# Altium schematic sheet [16] SPI_TYPEC_PWR.SchDoc
size B; Organization: Altium Limited; Address1: L3, 12a Rodborough Rd; Address2: Frenchs Forest; Address3: NSW; Address4: Australia 2086
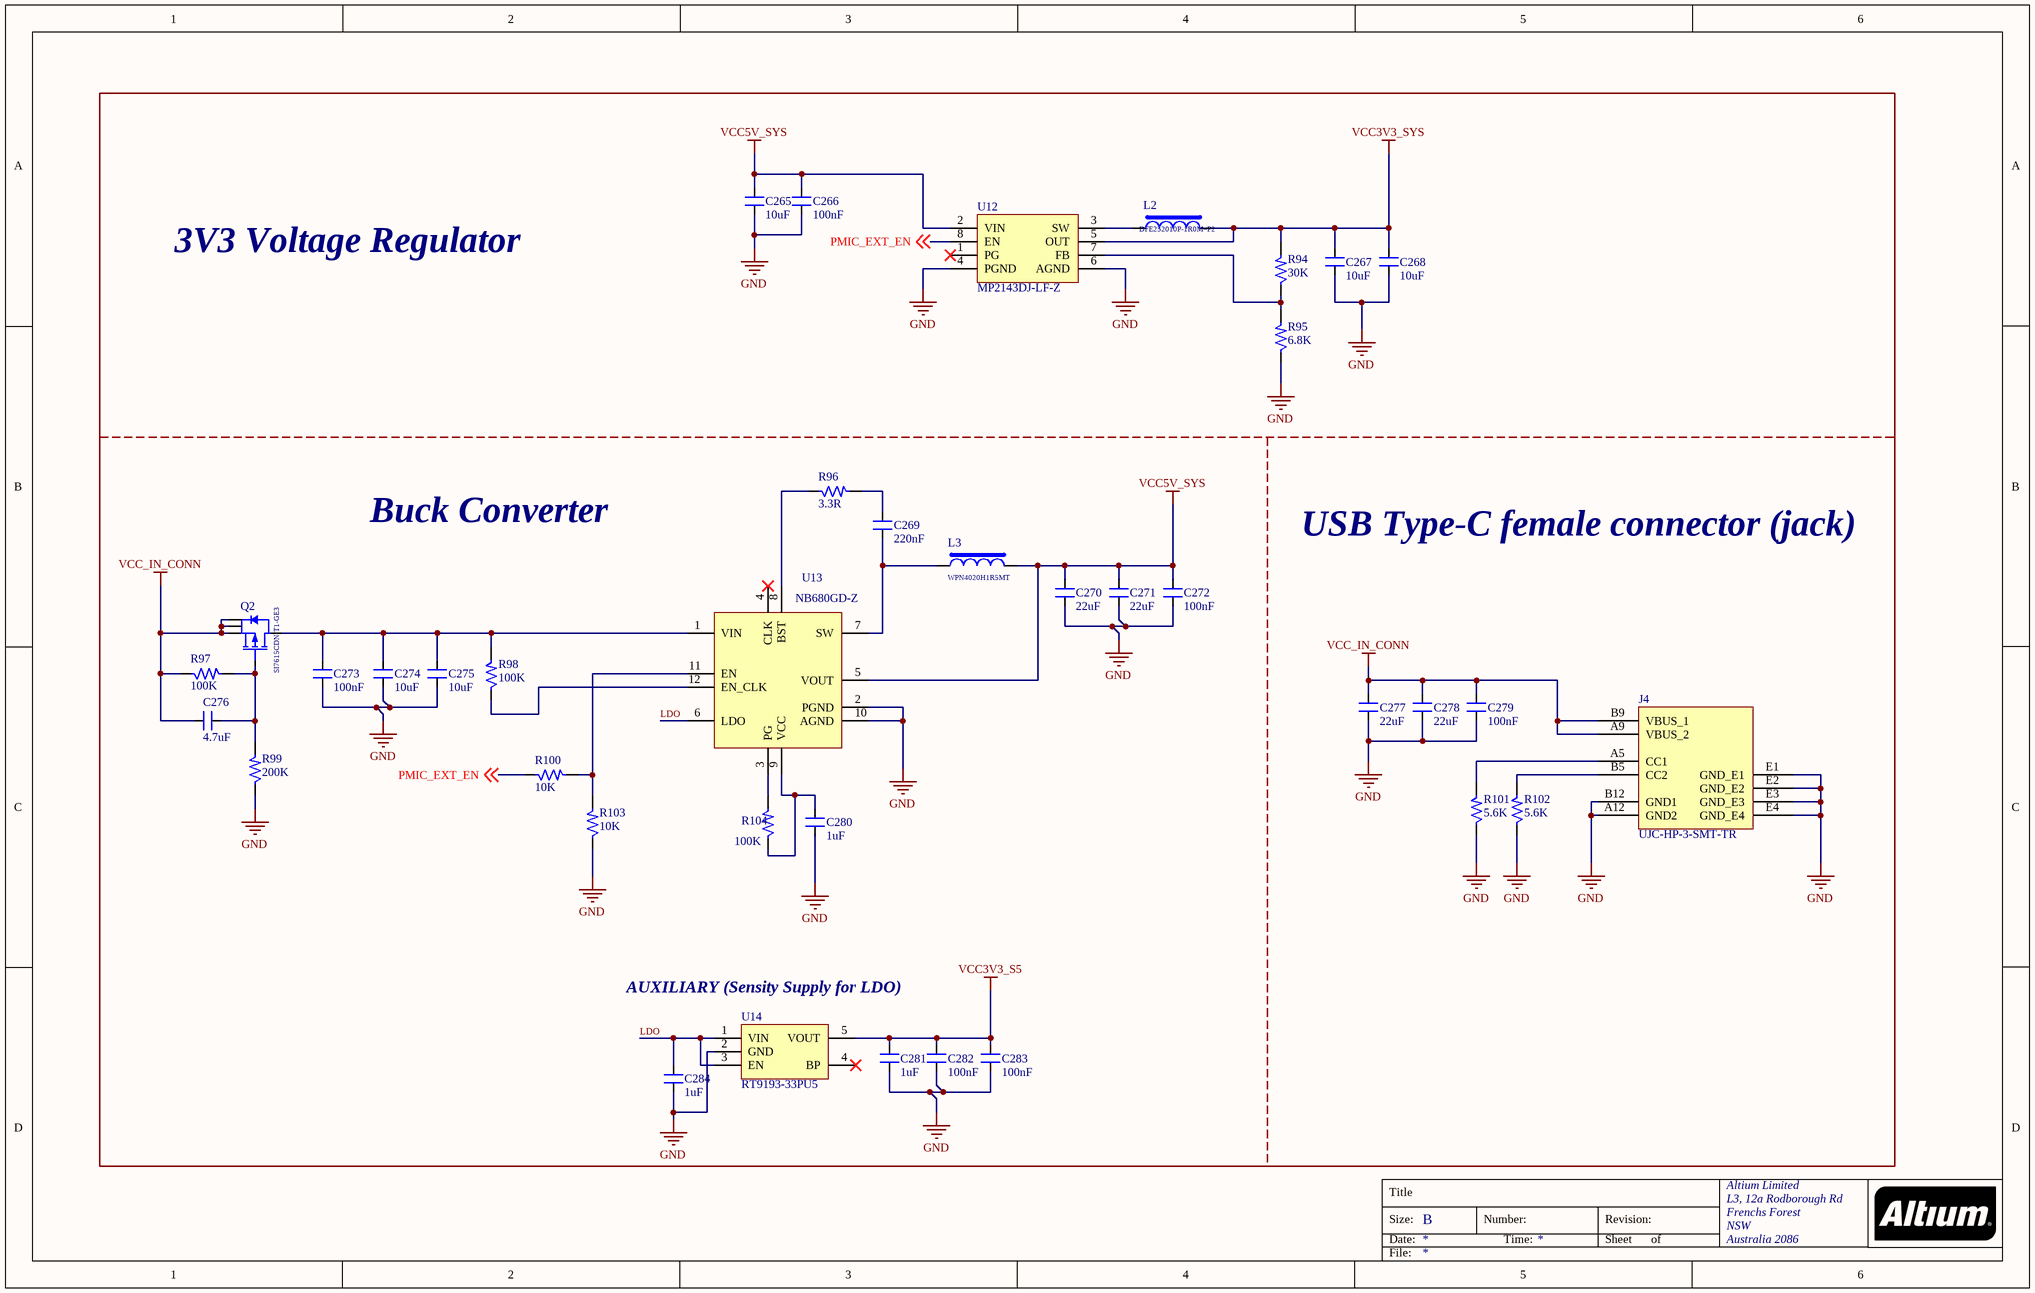
[diagram p0: [16] SPI_TYPEC_PWR.SchDoc]

## Parts
C265  10uF  [CAP_0402]
C266  100nF  [CAP_0402]
C267  10uF  [CAP_0402]
C268  10uF  [CAP_0402]
C269  220nF  [CAP_0402]
C270  22uF  [CAP_0402]
C271  22uF  [CAP_0402]
C272  100nF  [CAP_0402]
C273  100nF  [CAP_0402]
C274  10uF  [CAP_0402]
C275  10uF  [CAP_0402]
C276  4.7uF  [CAP_0402]
C277  22uF  [CAP_0402]
C278  22uF  [CAP_0402]
C279  100nF  [CAP_0201]
C280  1uF  [CAP_0402]
C281  1uF  [CAP_0402]
C282  100nF  [CAP_0402]
C283  100nF  [CAP_0402]
C284  1uF  [CAP_0402]
J4  UJC-HP-3-SMT-TR  [CON6_48.4_UJC-HP-3-SMT-TR]
L2  DFE252010P-1R0M=P2  [IND_1008]
L3  WPN4020H1R5MT  [IND_1616]
Q2  SI7615CDN-T1-GE3  [PowerPAK_1212-8_SMD]
R94  30K  [RES_0402]
R95  6.8K  [RES_0402]
R96  3.3R  [RES_0402]
R97  100K  [RES_0402]
R98  100K  [RES_0402]
R99  200K  [RES_0402]
R100  10K  [RES_0402]
R101  5.6K  [RES_0201]
R102  5.6K  [RES_0201]
R103  10K  [RES_0402]
R104  100K  [RES_0402]
U12  MP2143DJ-LF-Z  [SOT23-8]
U13  NB680GD-Z  [QFN-12_19_118X118_SMD]
U14  RT9193-33PU5  [SC70-5]

## Nets
GND: C265.1 C266.1 C267.1 C268.1 C270.1 C271.1 C272.1 C273.1 C274.1 C275.1 C277.1 C278.1 C279.1 C280.1 C281.1 C282.1 C283.1 C284.1 J4.A12(GND2) J4.B12(GND1) J4.E1(GND_E1) J4.E2(GND_E2) J4.E3(GND_E3) J4.E4(GND_E4) R95.1 R99.1 R101.1 R102.1 R103.1 U12.4(PGND) U12.6(AGND) U13.2(PGND) U13.10(AGND) U14.2(GND)
VCC3V3_S5: C281.2 C282.2 C283.2 U14.5(VOUT)
VCC3V3_SYS: C267.2 C268.2 L2.2 R94.2 U12.5(OUT)
VCC5V_SYS: C265.2 C266.2 C270.2 C271.2 C272.2 L3.2 U12.2(VIN) U13.5(VOUT)
VCC_IN_CONN: C276.1 C277.2 C278.2 C279.2 J4.A9(VBUS_2) J4.B9(VBUS_1) Q2.1(S) Q2.2(S) Q2.3(S) R97.1
LDO: C284.2 U13.6(LDO) U14.1(VIN) U14.3(EN)
PMIC_EXT_EN: R100.1 U12.8(EN) ; off-sheet PMIC_EXT_EN
NetC269_1: C269.1 L3.1 U13.7(SW)
NetC269_2: C269.2 R96.2
NetC273_2: C273.2 C274.2 C275.2 Q2.5(D) R98.2 U13.1(VIN)
NetC276_2: C276.2 Q2.4(G) R97.2 R99.2
NetC280_2: C280.2 R104.1 U13.9(VCC)
NetJ4_A5: J4.A5(CC1) R101.2
NetJ4_B5: J4.B5(CC2) R102.2
NetL2_1: L2.1 U12.3(SW)
NetR94_1: R94.1 R95.2 U12.7(FB)
NetR96_1: R96.1 U13.8(BST)
NetR98_1: R98.1 U13.12(EN_CLK)
NetR100_2: R100.2 R103.2 U13.11(EN)
NetR104_2: R104.2 U13.3(PG)

Not connected (* = marked no-connect by the designer): U12 1(PG)*; U13 4(CLK)*; U14 4(BP)*

## Notes on the sheet
- 3V3 Voltage Regulator
- Buck Converter
- USB Type-C female connector (jack)
- AUXILIARY (Sensity Supply for LDO)
- Title
- Size:
- Date:
- B
- Number:
- Time:
- Revision:
- Sheet
- of
- File:

## Library data of the parts
C265 C267 C268 C274 C275 = CAP_10uF-10V-20%-0402: 10µF ±20% 10V Ceramic Capacitor X5R 0402 (1005 Metric) /; Manufacturer Part Number: CL05A106MP5NUNC; Manufacturer: Samsung Electro-Mechanics; Case/Package: 0402; Supplier-1: Digikey
C266 = CAP_100nF-10V-10%-0402: 0.1µF ±10% 10V Ceramic Capacitor X7R 0402 (1005 Metric) /; Manufacturer: Yageo; Manufacturer Part Number: CC0402KRX7R6BB104; Case/Package: 0402; Supplier-1: Digikey
C269 = CAP_220nF-10V-10%-0402: 0.22µF ±10% 10V Ceramic Capacitor X7R 0402 (1005 Metric) /; Manufacturer: Samsung Electro-Mechanics; Manufacturer Part Number: CL05B224KP5NNNC; Case/Package: 0402; Supplier-1: Digikey
C270 C271 C277 C278 = CAP_22uF-6.3V-20%-0402: 22µF ±20% 6.3V Ceramic Capacitor X5R 0402 (1005 Metric) /; Manufacturer: Murata Electronics; Manufacturer Part Number: CL05A226MQ5N6J8; Case/Package: 0402; Supplier-1: Digikey
C272 C273 C282 C283 = CAP_100nF-25V-10%-0402: 0.1µF ±10% 25V Ceramic Capacitor X7R 0402 (1005 Metric) /; Manufacturer: Walsin Technology Corporation; Manufacturer Part Number: 0402B104K250CT; Case/Package: 0402; Supplier-1: Digikey
C276 = CAP_4.7uF-10V-10%-0402: 4.7µF ±10% 10V Ceramic Capacitor X5R 0402 (1005 Metric) /; Manufacturer: Samsung Electro-Mechanics; Manufacturer Part Number: CL05A475KP5NRNC; Case/Package: 0402; Supplier-1: Digikey
C279 = CAP_100nF-25V-10%-0201: 0.1µF ±10% 25V Ceramic Capacitor X5R 0201 (0603 Metric) /; Manufacturer: TDK Corporation; Manufacturer Part Number: C0603X5R1E104K030BB; Case/Package: 0201; Supplier-1: Digikey
C280 = CAP_1uF-16V-10%-0402: 1µF ±10% 16V Ceramic Capacitor X5R 0402 (1005 Metric) /; Manufacturer: Knowles Novacap; Manufacturer Part Number: 0402BW105K160YT; Case/Package: 0402; Supplier-1: Digikey
C281 C284 = CAP_1uF-10V-10%-0402: 1µF ±10% 10V Ceramic Capacitor X6S 0402 (1005 Metric) /; Manufacturer: Murata Electronics; Manufacturer Part Number: GRT155C81A105KE01D; Case/Package: 0402; Supplier-1: Digikey
J4 = CON-TYPEC_6X1-100-RA-TH: USB Connectors USB jack, C type, power only, 6 pin, horizonal, gold flash plating, surface mount, T&R; Manufacturer: CUI Devices; Manufacturer Part Number: UJC-HP-3-SMT-TR; Case/Package: TH; Supplier-1: Mouser
L2 = IND_1uH-3.8A-20%-1008: 1µH Shielded Wirewound Inductor 3.8A 54mOhm Max 1008 (2520 Metric) /; Manufacturer: Murata Electronics; Manufacturer Part Number: DFE252010P-1R0M=P2; Case/Package: 1008; Supplier-1: Digikey
L3 = IND_1.5uH-6A-20%-SMD: Wire Wound SMD Power Inductors – WPN Series / Operating Temp. : -40℃~+125℃ (Including self-heating) /; Manufacturer: Sunlord; Mnaufcaturer Part Number: WPN4020H1R5MT; Case/Package: SMD; Supplier-1: NA
Q2 = MOSFET-P_20V-35A-1212-8: P-Channel 20V 35A (Tc) 33W (Tc) Surface Mount PowerPAK® 1212-8 /; Manufacturer: Vishay Siliconix; Manufacturer Part Number: SI7615CDN-T1-GE3; Case/Package: PowerPAK® 1212-8; Supplier-1: Digikey
R94 = RES_30K-0.1W-1%-0402: 30 kOhms ±1% 0.1W, 1/10W Chip Resistor 0402 (1005 Metric) Automotive AEC-Q200, Moisture Resistant Thick Film /; Manufacturer: KOA Speer Electronics, Inc.; Manufacturer Part Number: RK73H1ETTP3002F; Case/Package: 0402; Supplier-1: Digikey
R95 = RES_6.8K-0.1W-1%-0402: 6.8 kOhms ±1% 0.1W, 1/10W Chip Resistor 0402 (1005 Metric) Anti-Sulfur Thin Film /; Manufacturer: Vishay Beyschlag/Draloric/BC Components; Manufacturer Part Number: MCS04020C6801FE000; Supplier-1: Digikey; Case/Package: 0402
R96 = RES_3.3R-0.1W-1%-0402: 3.3 Ohms ±1% 0.1W, 1/10W Chip Resistor 0402 (1005 Metric) Anti-Sulfur, Automotive AEC-Q200 Thick Film /; Manufacturer: Panasonic Electronic Components; Manufacturer Part Number: ERJ-U02F3R30X; Case/Package: 0402; Supplier-1: Digikey
R97 R98 R104 = RES_100K-0.1W-1%-0402: 100 kOhms ±1% 0.1W, 1/10W Chip Resistor 0402 (1005 Metric) Anti-Sulfur Thin Film /; Manufacturer: Vishay Beyschlag/Draloric/BC Components; Manufacturer Part Number: MCS04020C1003FE000; Case/Package: 0402; Supplier-1: Digikey
R99 = RES_200K-0.1W-1%-0402: 200 kOhms ±1% 0.1W, 1/10W Chip Resistor 0402 (1005 Metric) Automotive AEC-Q200 Thick Film /; Manufacturer: Panasonic Electronic Components; Manufacturer Part number: ERJ-2RKF2003X; Case/Package: 0402; Supplier-1: Digikey
R100 R103 = RES_10K-0.1W-1%-0402: 10 kOhms ±1% 0.1W, 1/10W Chip Resistor 0402 (1005 Metric) Anti-Sulfur Thin Film /; Manufacturer: Vishay Beyschlag/Draloric/BC Components; Manufacturer Part Number: MCS04020C1002FE000; Case/Package: 0402; Supplier-1: Digikey
R101 R102 = RES_5.6K-0.05W-1%-0201: 5.6 kOhms ±1% 0.05W, 1/20W Chip Resistor 0201 (0603 Metric) Automotive AEC-Q200 Thick Film /; Manufacturer: Panasonic Electronic Components; Manufacturer Part Number: ERJ-1GNF5601C; Case/Package: 0201; Supplier-1: Digikey
U12 = REG_0.6~5V-5.5V-3A-TSOT-23-8: Switching Voltage Regulators 3A, 5.5V, 1.2MHz Sync Stp-Dwn Swtchr; Manufacturer: Monolithic Power Systems (MPS); Manufacturer Part Number: MP2143DJ-LF-Z; Case/Package: TSOT-23-8; Supplier-1: Mouser
U13 = REG_3.3V-26V-8A-QFN-12: Switching Voltage Regulators 26V Fixed 3.3 V-8A Sync Buck Converter; Manufacturer: Monolithic Power Systems (MPS); Manufacturer Part Number: NB680GD-Z; Case/Package: QFN-12; Supplier-1: Mouser
U14 = REG_3.3V-5.5V-300mA-SC-70-5: SC-70-5 Dropout Regulators(LDO) RoHS; Manufacturer: Richtek Tech; Manufacturer Part Number: RT9193-33PU5; Case/Package: SC-70-5; Supplier-1: LCSC